# Altium schematic sheet decoders.SchDoc: 5-to-32 Decoder
size A4; Revision: 1.0.0; SheetNumber: 4; SheetTotal: 10
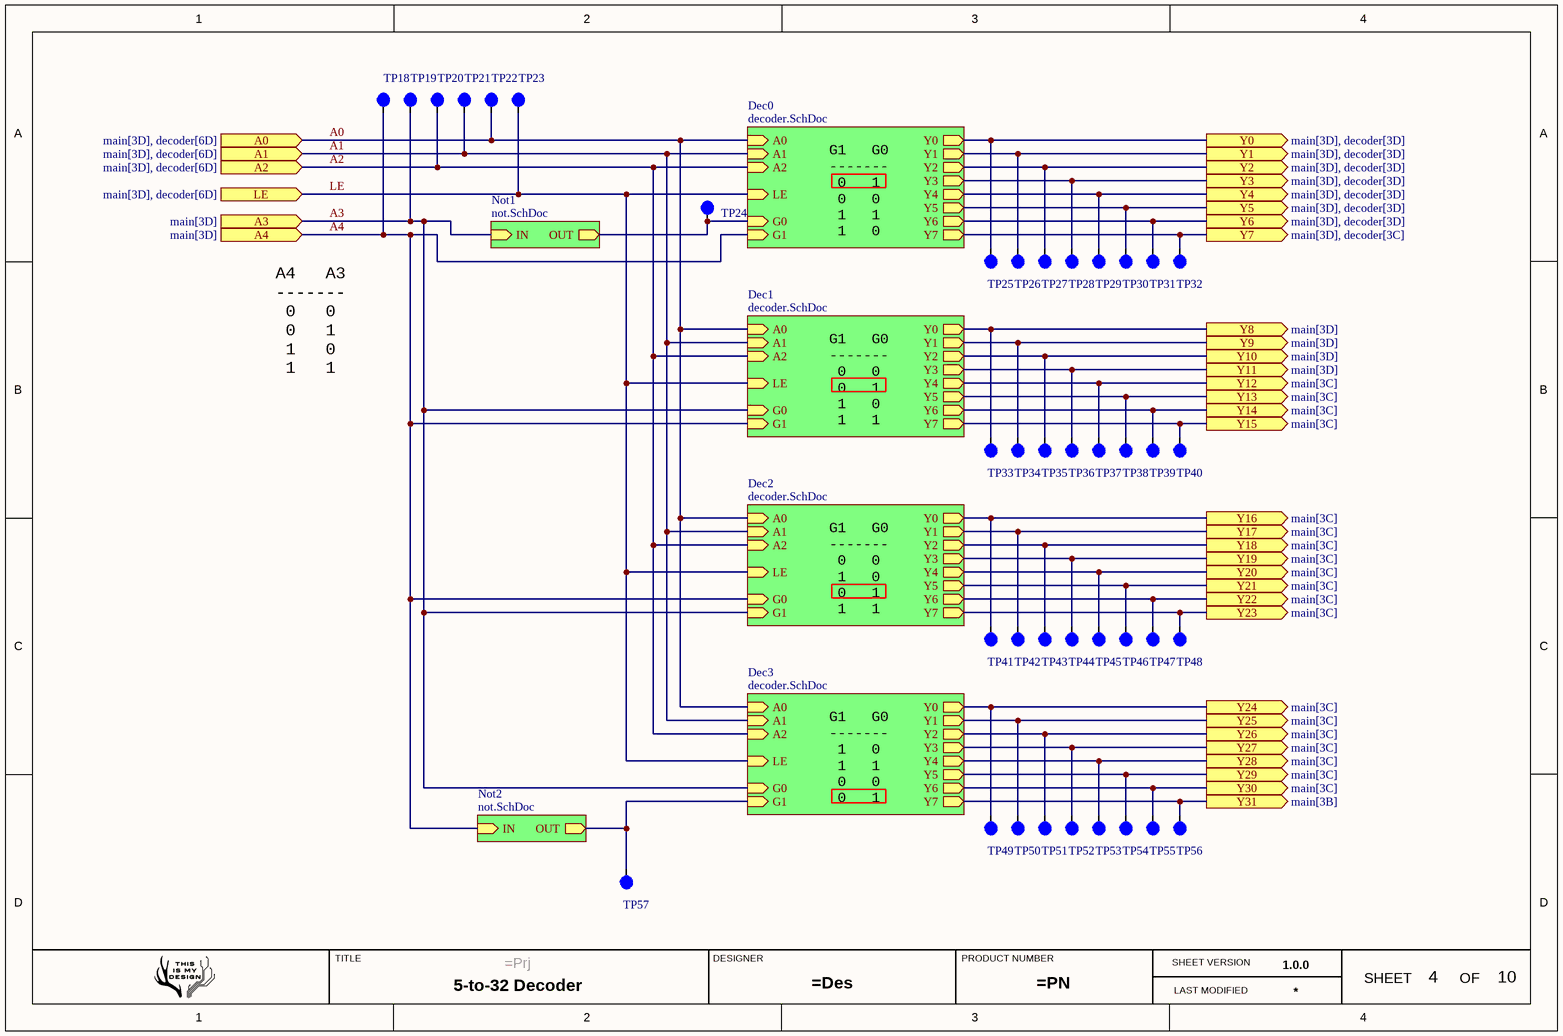
[diagram p0: decoders.SchDoc]

## Parts
TP18  Test Point  [TEST_POINT_0R5]  (value not drawn)  (no BOM)
TP19  Test Point  [TEST_POINT_0R5]  (value not drawn)  (no BOM)
TP20  Test Point  [TEST_POINT_0R5]  (value not drawn)  (no BOM)
TP21  Test Point  [TEST_POINT_0R5]  (value not drawn)  (no BOM)
TP22  Test Point  [TEST_POINT_0R5]  (value not drawn)  (no BOM)
TP23  Test Point  [TEST_POINT_0R5]  (value not drawn)  (no BOM)
TP24  Test Point  [TEST_POINT_0R5]  (value not drawn)  (no BOM)
TP25  Test Point  [TEST_POINT_0R5]  (value not drawn)  (no BOM)
TP26  Test Point  [TEST_POINT_0R5]  (value not drawn)  (no BOM)
TP27  Test Point  [TEST_POINT_0R5]  (value not drawn)  (no BOM)
TP28  Test Point  [TEST_POINT_0R5]  (value not drawn)  (no BOM)
TP29  Test Point  [TEST_POINT_0R5]  (value not drawn)  (no BOM)
TP30  Test Point  [TEST_POINT_0R5]  (value not drawn)  (no BOM)
TP31  Test Point  [TEST_POINT_0R5]  (value not drawn)  (no BOM)
TP32  Test Point  [TEST_POINT_0R5]  (value not drawn)  (no BOM)
TP33  Test Point  [TEST_POINT_0R5]  (value not drawn)  (no BOM)
TP34  Test Point  [TEST_POINT_0R5]  (value not drawn)  (no BOM)
TP35  Test Point  [TEST_POINT_0R5]  (value not drawn)  (no BOM)
TP36  Test Point  [TEST_POINT_0R5]  (value not drawn)  (no BOM)
TP37  Test Point  [TEST_POINT_0R5]  (value not drawn)  (no BOM)
TP38  Test Point  [TEST_POINT_0R5]  (value not drawn)  (no BOM)
TP39  Test Point  [TEST_POINT_0R5]  (value not drawn)  (no BOM)
TP40  Test Point  [TEST_POINT_0R5]  (value not drawn)  (no BOM)
TP41  Test Point  [TEST_POINT_0R5]  (value not drawn)  (no BOM)
TP42  Test Point  [TEST_POINT_0R5]  (value not drawn)  (no BOM)
TP43  Test Point  [TEST_POINT_0R5]  (value not drawn)  (no BOM)
TP44  Test Point  [TEST_POINT_0R5]  (value not drawn)  (no BOM)
TP45  Test Point  [TEST_POINT_0R5]  (value not drawn)  (no BOM)
TP46  Test Point  [TEST_POINT_0R5]  (value not drawn)  (no BOM)
TP47  Test Point  [TEST_POINT_0R5]  (value not drawn)  (no BOM)
TP48  Test Point  [TEST_POINT_0R5]  (value not drawn)  (no BOM)
TP49  Test Point  [TEST_POINT_0R5]  (value not drawn)  (no BOM)
TP50  Test Point  [TEST_POINT_0R5]  (value not drawn)  (no BOM)
TP51  Test Point  [TEST_POINT_0R5]  (value not drawn)  (no BOM)
TP52  Test Point  [TEST_POINT_0R5]  (value not drawn)  (no BOM)
TP53  Test Point  [TEST_POINT_0R5]  (value not drawn)  (no BOM)
TP54  Test Point  [TEST_POINT_0R5]  (value not drawn)  (no BOM)
TP55  Test Point  [TEST_POINT_0R5]  (value not drawn)  (no BOM)
TP56  Test Point  [TEST_POINT_0R5]  (value not drawn)  (no BOM)
TP57  Test Point  [TEST_POINT_0R5]  (value not drawn)  (no BOM)

## Sub-sheets
Dec0 = decoder.SchDoc: Y0 (out), Y1 (out), Y2 (out), Y3 (out), Y4 (out), Y5 (out), Y6 (out), Y7 (out), A0 (in), A1 (in), A2 (in), LE (in), G0 (in), G1 (in)
Dec1 = decoder.SchDoc: Y0 (out), Y1 (out), Y2 (out), Y3 (out), Y4 (out), Y5 (out), Y6 (out), Y7 (out), A0 (in), A1 (in), A2 (in), LE (in), G0 (in), G1 (in)
Dec2 = decoder.SchDoc: Y0 (out), Y1 (out), Y2 (out), Y3 (out), Y4 (out), Y5 (out), Y6 (out), Y7 (out), A0 (in), A1 (in), A2 (in), LE (in), G0 (in), G1 (in)
Dec3 = decoder.SchDoc: Y0 (out), Y1 (out), Y2 (out), Y3 (out), Y4 (out), Y5 (out), Y6 (out), Y7 (out), A0 (in), A1 (in), A2 (in), LE (in), G0 (in), G1 (in)
Not1 = not.SchDoc: IN (in), OUT (out)
Not2 = not.SchDoc: IN (in), OUT (out)

## Ports
A0 (in, see main[3D], decoder[6D]), A1 (in, see main[3D], decoder[6D]), A2 (in, see main[3D], decoder[6D]), A3 (in, see main[3D]), A4 (in, see main[3D]), LE (in, see main[3D], decoder[6D]), Y0 (out, see main[3D], decoder[3D]), Y1 (out, see main[3D], decoder[3D]), Y2 (out, see main[3D], decoder[3D]), Y3 (out, see main[3D], decoder[3D]), Y4 (out, see main[3D], decoder[3D]), Y5 (out, see main[3D], decoder[3D]), Y6 (out, see main[3D], decoder[3D]), Y7 (out, see main[3D], decoder[3C]), Y8 (out, see main[3D]), Y9 (out, see main[3D]), Y10 (out, see main[3D]), Y11 (out, see main[3D]), Y12 (out, see main[3C]), Y13 (out, see main[3C]), Y14 (out, see main[3C]), Y15 (out, see main[3C]), Y16 (out, see main[3C]), Y17 (out, see main[3C]), Y18 (out, see main[3C]), Y19 (out, see main[3C]), Y20 (out, see main[3C]), Y21 (out, see main[3C]), Y22 (out, see main[3C]), Y23 (out, see main[3C]), Y24 (out, see main[3C]), Y25 (out, see main[3C]), Y26 (out, see main[3C]), Y27 (out, see main[3C]), Y28 (out, see main[3C]), Y29 (out, see main[3C]), Y30 (out, see main[3C]), Y31 (out, see main[3B])

## Nets
A0: TP22.0 ; port A0, sheet Dec0/A0, sheet Dec1/A0, sheet Dec2/A0, sheet Dec3/A0
A1: TP21.0 ; port A1, sheet Dec0/A1, sheet Dec1/A1, sheet Dec2/A1, sheet Dec3/A1
A2: TP20.0 ; port A2, sheet Dec0/A2, sheet Dec1/A2, sheet Dec2/A2, sheet Dec3/A2
A3: TP19.0 ; port A3, sheet Dec1/G0, sheet Dec2/G1, sheet Dec3/G0, sheet Not1/IN
A4: TP18.0 ; port A4, sheet Dec0/G1, sheet Dec1/G1, sheet Dec2/G0, sheet Not2/IN
LE: TP23.0 ; port LE, sheet Dec0/LE, sheet Dec1/LE, sheet Dec2/LE, sheet Dec3/LE
Y0: TP25.0 ; port Y0, sheet Dec0/Y0
Y1: TP26.0 ; port Y1, sheet Dec0/Y1
Y2: TP27.0 ; port Y2, sheet Dec0/Y2
Y3: TP28.0 ; port Y3, sheet Dec0/Y3
Y4: TP29.0 ; port Y4, sheet Dec0/Y4
Y5: TP30.0 ; port Y5, sheet Dec0/Y5
Y6: TP31.0 ; port Y6, sheet Dec0/Y6
Y7: TP32.0 ; port Y7, sheet Dec0/Y7
Y8: TP33.0 ; port Y8, sheet Dec1/Y0
Y9: TP34.0 ; port Y9, sheet Dec1/Y1
Y10: TP35.0 ; port Y10, sheet Dec1/Y2
Y11: TP36.0 ; port Y11, sheet Dec1/Y3
Y12: TP37.0 ; port Y12, sheet Dec1/Y4
Y13: TP38.0 ; port Y13, sheet Dec1/Y5
Y14: TP39.0 ; port Y14, sheet Dec1/Y6
Y15: TP40.0 ; port Y15, sheet Dec1/Y7
Y16: TP41.0 ; port Y16, sheet Dec2/Y0
Y17: TP42.0 ; port Y17, sheet Dec2/Y1
Y18: TP43.0 ; port Y18, sheet Dec2/Y2
Y19: TP44.0 ; port Y19, sheet Dec2/Y3
Y20: TP45.0 ; port Y20, sheet Dec2/Y4
Y21: TP46.0 ; port Y21, sheet Dec2/Y5
Y22: TP47.0 ; port Y22, sheet Dec2/Y6
Y23: TP48.0 ; port Y23, sheet Dec2/Y7
Y24: TP49.0 ; port Y24, sheet Dec3/Y0
Y25: TP50.0 ; port Y25, sheet Dec3/Y1
Y26: TP51.0 ; port Y26, sheet Dec3/Y2
Y27: TP52.0 ; port Y27, sheet Dec3/Y3
Y28: TP53.0 ; port Y28, sheet Dec3/Y4
Y29: TP54.0 ; port Y29, sheet Dec3/Y5
Y30: TP55.0 ; port Y30, sheet Dec3/Y6
Y31: TP56.0 ; port Y31, sheet Dec3/Y7
NetTP24_0: TP24.0 ; sheet Dec0/G0, sheet Not1/OUT
NetTP57_0: TP57.0 ; sheet Dec3/G1, sheet Not2/OUT

## Notes on the sheet
- G1   G0
  -------
  0   1
  0   0
  1   1
  1   0
- A4   A3
  -------
  0   0
  0   1
  1   0
  1   1
- G1   G0
  -------
  0   0
  0   1
  1   0
  1   1
- G1   G0
  -------
  0   0
  1   0
  0   1
  1   1
- G1   G0
  -------
  1   0
  1   1
  0   0
  0   1
- TITLE
- DESIGNER
- PRODUCT NUMBER
- SHEET VERSION
- LAST MODIFIED
- SHEET
- OF

## Library data of the parts
TP18-TP57 = Test Point: PCB Test Point